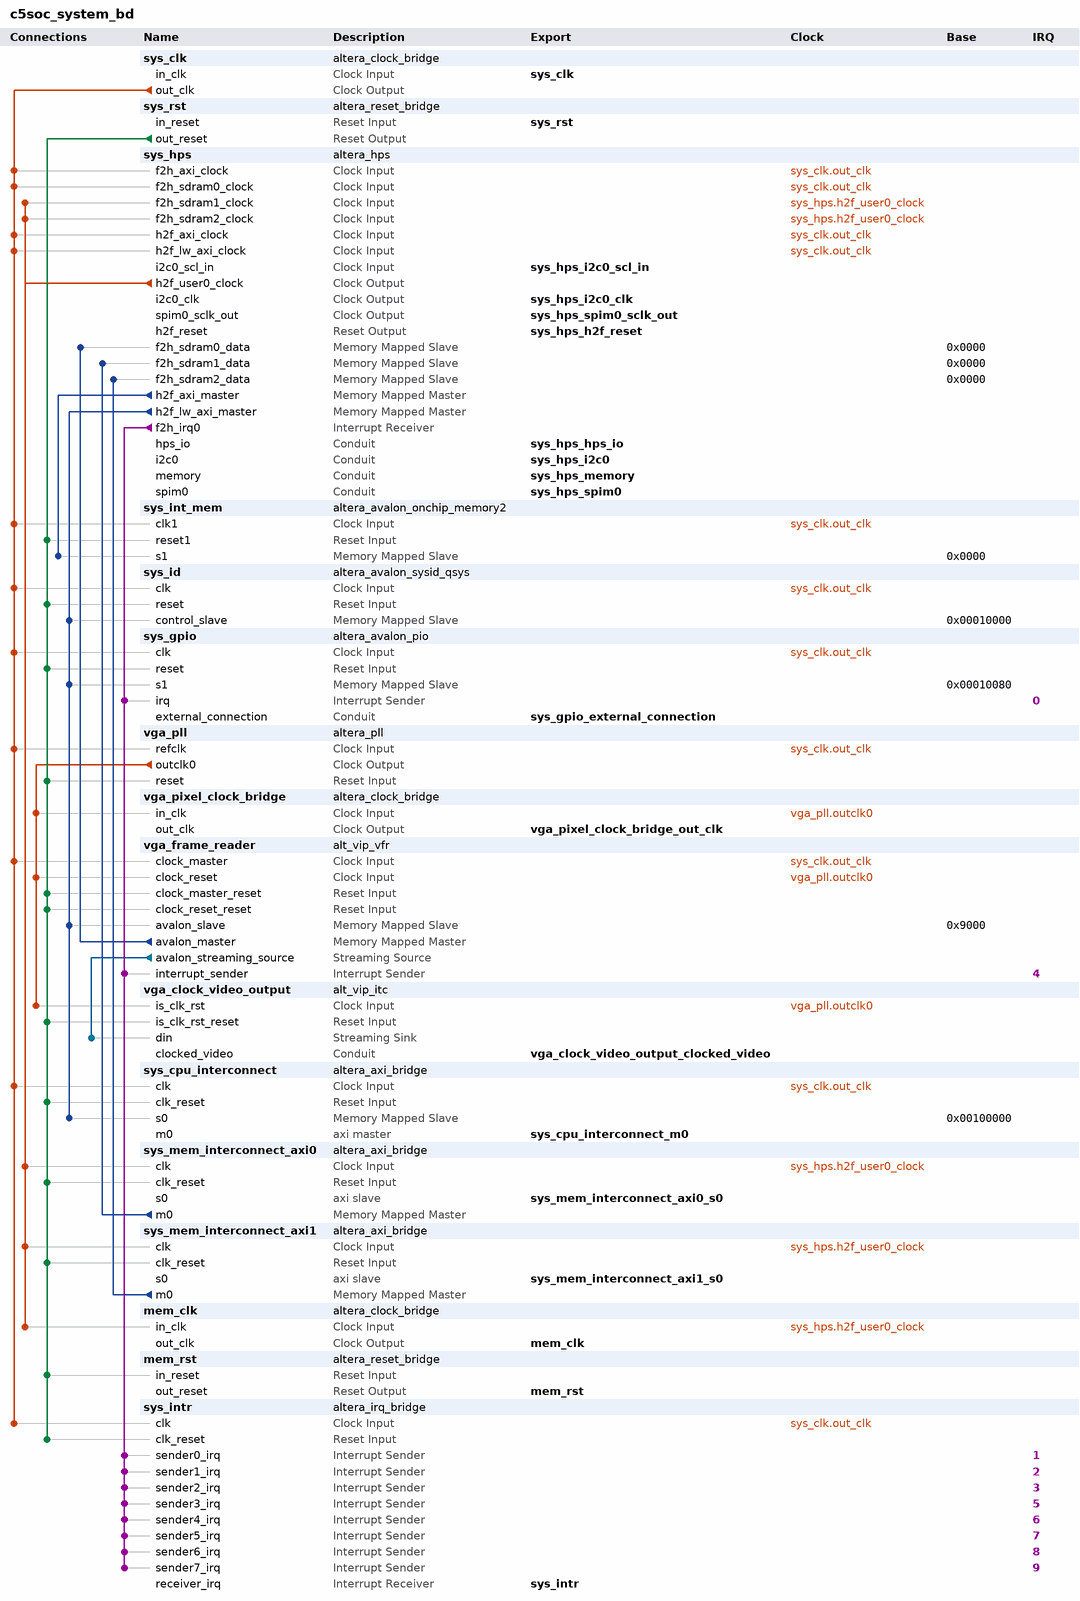
[diagram p0: system contents]
# Platform Designer (Qsys) system c5soc_system_bd, Cyclone V 5CSXFC6D6F31C8ES
# Parameters at their usual value, and those the tool derives, are not listed.
package require -exact qsys 16.0
create_system c5soc_system_bd
set_project_property DEVICE_FAMILY {Cyclone V}
set_project_property DEVICE 5CSXFC6D6F31C8ES

add_instance sys_clk altera_clock_bridge 16.0
set_instance_parameter_value sys_clk DERIVED_CLOCK_RATE 0
set_instance_parameter_value sys_clk EXPLICIT_CLOCK_RATE 0

add_instance sys_rst altera_reset_bridge 16.0
set_instance_parameter_value sys_rst ACTIVE_LOW_RESET 0
set_instance_parameter_value sys_rst SYNCHRONOUS_EDGES none

add_instance sys_hps altera_hps 16.0
set_instance_parameter_value sys_hps EMAC1_Mode RGMII
set_instance_parameter_value sys_hps EMAC1_PinMuxing {HPS I/O Set 0}
set_instance_parameter_value sys_hps F2SCLK_COLDRST_Enable false
set_instance_parameter_value sys_hps F2SCLK_DBGRST_Enable false
set_instance_parameter_value sys_hps F2SCLK_WARMRST_Enable false
set_instance_parameter_value sys_hps F2SDRAM_Type {Avalon-MM Bidirectional,AXI-3,AXI-3}
set_instance_parameter_value sys_hps F2SDRAM_Width 64,64,64
set_instance_parameter_value sys_hps F2SINTERRUPT_Enable true
set_instance_parameter_value sys_hps F2S_Width 2
set_instance_parameter_value sys_hps FPGA_PERIPHERAL_OUTPUT_CLOCK_FREQ_EMAC0_GTX_CLK 100
set_instance_parameter_value sys_hps FPGA_PERIPHERAL_OUTPUT_CLOCK_FREQ_EMAC0_MD_CLK 100.0
set_instance_parameter_value sys_hps FPGA_PERIPHERAL_OUTPUT_CLOCK_FREQ_EMAC1_GTX_CLK 100
set_instance_parameter_value sys_hps FPGA_PERIPHERAL_OUTPUT_CLOCK_FREQ_EMAC1_MD_CLK 100.0
set_instance_parameter_value sys_hps HPS_PROTOCOL DDR3
set_instance_parameter_value sys_hps I2C0_Mode Full
set_instance_parameter_value sys_hps I2C0_PinMuxing FPGA
set_instance_parameter_value sys_hps I2C1_Mode N/A
set_instance_parameter_value sys_hps I2C1_PinMuxing Unused
set_instance_parameter_value sys_hps LWH2F_Enable true
set_instance_parameter_value sys_hps MEM_BANKADDR_WIDTH 3
set_instance_parameter_value sys_hps MEM_CLK_FREQ 400.0
set_instance_parameter_value sys_hps MEM_COL_ADDR_WIDTH 10
set_instance_parameter_value sys_hps MEM_DQ_WIDTH 32
set_instance_parameter_value sys_hps MEM_DRV_STR RZQ/7
set_instance_parameter_value sys_hps MEM_ROW_ADDR_WIDTH 15
set_instance_parameter_value sys_hps MEM_RTT_NOM RZQ/4
set_instance_parameter_value sys_hps MEM_RTT_WR RZQ/4
set_instance_parameter_value sys_hps MEM_TCL 11
set_instance_parameter_value sys_hps MEM_TFAW_NS 30.0
set_instance_parameter_value sys_hps MEM_TRAS_NS 35.0
set_instance_parameter_value sys_hps MEM_TRCD_NS 13.75
set_instance_parameter_value sys_hps MEM_TRFC_NS 260.0
set_instance_parameter_value sys_hps MEM_TRP_NS 13.75
set_instance_parameter_value sys_hps MEM_VENDOR JEDEC
set_instance_parameter_value sys_hps MEM_WTCL 8
set_instance_parameter_value sys_hps QSPI_Mode {1 SS}
set_instance_parameter_value sys_hps QSPI_PinMuxing {HPS I/O Set 0}
set_instance_parameter_value sys_hps REF_CLK_FREQ 25.0
set_instance_parameter_value sys_hps S2FCLK_USER0CLK_Enable true
set_instance_parameter_value sys_hps S2FCLK_USER2CLK 4
set_instance_parameter_value sys_hps S2F_Width 2
set_instance_parameter_value sys_hps SDIO_Mode {4-bit Data}
set_instance_parameter_value sys_hps SDIO_PinMuxing {HPS I/O Set 0}
set_instance_parameter_value sys_hps SPIM0_Mode Full
set_instance_parameter_value sys_hps SPIM0_PinMuxing FPGA
set_instance_parameter_value sys_hps SPIM1_Mode {Single Slave Select}
set_instance_parameter_value sys_hps SPIM1_PinMuxing {HPS I/O Set 0}
set_instance_parameter_value sys_hps STM_Enable false
set_instance_parameter_value sys_hps TIMING_BOARD_AC_SKEW 0.03
set_instance_parameter_value sys_hps TIMING_BOARD_AC_TO_CK_SKEW 0.0
set_instance_parameter_value sys_hps TIMING_BOARD_DQ_TO_DQS_SKEW 0.0
set_instance_parameter_value sys_hps TIMING_BOARD_MAX_CK_DELAY 0.03
set_instance_parameter_value sys_hps TIMING_BOARD_MAX_DQS_DELAY 0.02
set_instance_parameter_value sys_hps TIMING_BOARD_SKEW_BETWEEN_DQS 0.08
set_instance_parameter_value sys_hps TIMING_BOARD_SKEW_CKDQS_DIMM_MAX 0.16
set_instance_parameter_value sys_hps TIMING_BOARD_SKEW_CKDQS_DIMM_MIN 0.09
set_instance_parameter_value sys_hps TIMING_BOARD_SKEW_WITHIN_DQS 0.01
set_instance_parameter_value sys_hps TIMING_TDH 65
set_instance_parameter_value sys_hps TIMING_TDQSCK 255
set_instance_parameter_value sys_hps TIMING_TDQSQ 125
set_instance_parameter_value sys_hps TIMING_TDS 30
set_instance_parameter_value sys_hps TIMING_TIH 140
set_instance_parameter_value sys_hps TIMING_TIS 180
set_instance_parameter_value sys_hps TIMING_TQSH 0.4
set_instance_parameter_value sys_hps UART0_Mode {No Flow Control}
set_instance_parameter_value sys_hps UART0_PinMuxing {HPS I/O Set 0}
set_instance_parameter_value sys_hps USB1_Mode SDR
set_instance_parameter_value sys_hps USB1_PinMuxing {HPS I/O Set 0}
set_instance_parameter_value sys_hps desired_cfg_clk_mhz 80.0
set_instance_parameter_value sys_hps desired_qspi_clk_mhz 400.0

add_instance sys_int_mem altera_avalon_onchip_memory2 16.0
set_instance_parameter_value sys_int_mem dataWidth 64
set_instance_parameter_value sys_int_mem dualPort false
set_instance_parameter_value sys_int_mem initMemContent true
set_instance_parameter_value sys_int_mem initializationFileName onchip_memory2_0
set_instance_parameter_value sys_int_mem memorySize 65536

add_instance sys_id altera_avalon_sysid_qsys 16.0
set_instance_parameter_value sys_id id -1395322110

add_instance sys_gpio altera_avalon_pio 16.0
set_instance_parameter_value sys_gpio bitClearingEdgeCapReg true
set_instance_parameter_value sys_gpio captureEdge true
set_instance_parameter_value sys_gpio direction InOut
set_instance_parameter_value sys_gpio edgeType ANY
set_instance_parameter_value sys_gpio generateIRQ true
set_instance_parameter_value sys_gpio irqType EDGE
set_instance_parameter_value sys_gpio width 32

add_instance vga_pll altera_pll 16.0
set_instance_parameter_value vga_pll gui_device_speed_grade 2
set_instance_parameter_value vga_pll gui_number_of_clocks 2
set_instance_parameter_value vga_pll gui_operation_mode direct
set_instance_parameter_value vga_pll gui_output_clock_frequency0 85.5
set_instance_parameter_value vga_pll gui_output_clock_frequency1 171.0
set_instance_parameter_value vga_pll gui_pll_mode {Integer-N PLL}
set_instance_parameter_value vga_pll gui_reference_clock_frequency 50.0
set_instance_parameter_value vga_pll gui_use_locked false

add_instance vga_pixel_clock_bridge altera_clock_bridge 16.0
set_instance_parameter_value vga_pixel_clock_bridge DERIVED_CLOCK_RATE 85500000
set_instance_parameter_value vga_pixel_clock_bridge EXPLICIT_CLOCK_RATE 0

add_instance vga_frame_reader alt_vip_vfr 14.0
set_instance_parameter_value vga_frame_reader MAX_IMAGE_WIDTH 1360

add_instance vga_clock_video_output alt_vip_itc 14.0
set_instance_parameter_value vga_clock_video_output FIFO_DEPTH 1920
set_instance_parameter_value vga_clock_video_output H_ACTIVE_PIXELS 1360
set_instance_parameter_value vga_clock_video_output H_BACK_PORCH 256
set_instance_parameter_value vga_clock_video_output H_FRONT_PORCH 64
set_instance_parameter_value vga_clock_video_output H_SYNC_LENGTH 112
set_instance_parameter_value vga_clock_video_output NUMBER_OF_COLOUR_PLANES 4
set_instance_parameter_value vga_clock_video_output THRESHOLD 1919
set_instance_parameter_value vga_clock_video_output V_ACTIVE_LINES 768
set_instance_parameter_value vga_clock_video_output V_BACK_PORCH 18
set_instance_parameter_value vga_clock_video_output V_FRONT_PORCH 3
set_instance_parameter_value vga_clock_video_output V_SYNC_LENGTH 6

add_instance sys_cpu_interconnect altera_axi_bridge 16.0
set_instance_parameter_value sys_cpu_interconnect ADDR_WIDTH 20
set_instance_parameter_value sys_cpu_interconnect AXI_VERSION AXI3
set_instance_parameter_value sys_cpu_interconnect COMBINED_ACCEPTANCE_CAPABILITY 16
set_instance_parameter_value sys_cpu_interconnect COMBINED_ISSUING_CAPABILITY 16
set_instance_parameter_value sys_cpu_interconnect DATA_WIDTH 32
set_instance_parameter_value sys_cpu_interconnect M0_ID_WIDTH 12
set_instance_parameter_value sys_cpu_interconnect READ_ACCEPTANCE_CAPABILITY 16
set_instance_parameter_value sys_cpu_interconnect READ_ADDR_USER_WIDTH 64
set_instance_parameter_value sys_cpu_interconnect READ_DATA_REORDERING_DEPTH 1
set_instance_parameter_value sys_cpu_interconnect READ_DATA_USER_WIDTH 64
set_instance_parameter_value sys_cpu_interconnect READ_ISSUING_CAPABILITY 16
set_instance_parameter_value sys_cpu_interconnect S0_ID_WIDTH 12
set_instance_parameter_value sys_cpu_interconnect USE_M0_ARBURST 1
set_instance_parameter_value sys_cpu_interconnect USE_M0_ARCACHE 1
set_instance_parameter_value sys_cpu_interconnect USE_M0_ARID 1
set_instance_parameter_value sys_cpu_interconnect USE_M0_ARLEN 1
set_instance_parameter_value sys_cpu_interconnect USE_M0_ARLOCK 1
set_instance_parameter_value sys_cpu_interconnect USE_M0_ARQOS 1
set_instance_parameter_value sys_cpu_interconnect USE_M0_ARREGION 1
set_instance_parameter_value sys_cpu_interconnect USE_M0_ARSIZE 1
set_instance_parameter_value sys_cpu_interconnect USE_M0_ARUSER 0
set_instance_parameter_value sys_cpu_interconnect USE_M0_AWBURST 1
set_instance_parameter_value sys_cpu_interconnect USE_M0_AWCACHE 1
set_instance_parameter_value sys_cpu_interconnect USE_M0_AWID 1
set_instance_parameter_value sys_cpu_interconnect USE_M0_AWLEN 1
set_instance_parameter_value sys_cpu_interconnect USE_M0_AWLOCK 1
set_instance_parameter_value sys_cpu_interconnect USE_M0_AWQOS 1
set_instance_parameter_value sys_cpu_interconnect USE_M0_AWREGION 1
set_instance_parameter_value sys_cpu_interconnect USE_M0_AWSIZE 1
set_instance_parameter_value sys_cpu_interconnect USE_M0_AWUSER 0
set_instance_parameter_value sys_cpu_interconnect USE_M0_BID 1
set_instance_parameter_value sys_cpu_interconnect USE_M0_BRESP 1
set_instance_parameter_value sys_cpu_interconnect USE_M0_BUSER 0
set_instance_parameter_value sys_cpu_interconnect USE_M0_RID 1
set_instance_parameter_value sys_cpu_interconnect USE_M0_RLAST 1
set_instance_parameter_value sys_cpu_interconnect USE_M0_RRESP 1
set_instance_parameter_value sys_cpu_interconnect USE_M0_RUSER 0
set_instance_parameter_value sys_cpu_interconnect USE_M0_WSTRB 1
set_instance_parameter_value sys_cpu_interconnect USE_M0_WUSER 0
set_instance_parameter_value sys_cpu_interconnect USE_PIPELINE 1
set_instance_parameter_value sys_cpu_interconnect USE_S0_ARCACHE 1
set_instance_parameter_value sys_cpu_interconnect USE_S0_ARLOCK 1
set_instance_parameter_value sys_cpu_interconnect USE_S0_ARPROT 1
set_instance_parameter_value sys_cpu_interconnect USE_S0_ARQOS 1
set_instance_parameter_value sys_cpu_interconnect USE_S0_ARREGION 1
set_instance_parameter_value sys_cpu_interconnect USE_S0_ARUSER 0
set_instance_parameter_value sys_cpu_interconnect USE_S0_AWCACHE 1
set_instance_parameter_value sys_cpu_interconnect USE_S0_AWLOCK 1
set_instance_parameter_value sys_cpu_interconnect USE_S0_AWPROT 1
set_instance_parameter_value sys_cpu_interconnect USE_S0_AWQOS 1
set_instance_parameter_value sys_cpu_interconnect USE_S0_AWREGION 1
set_instance_parameter_value sys_cpu_interconnect USE_S0_AWUSER 0
set_instance_parameter_value sys_cpu_interconnect USE_S0_BRESP 1
set_instance_parameter_value sys_cpu_interconnect USE_S0_BUSER 0
set_instance_parameter_value sys_cpu_interconnect USE_S0_RRESP 1
set_instance_parameter_value sys_cpu_interconnect USE_S0_RUSER 0
set_instance_parameter_value sys_cpu_interconnect USE_S0_WLAST 1
set_instance_parameter_value sys_cpu_interconnect USE_S0_WUSER 0
set_instance_parameter_value sys_cpu_interconnect WRITE_ACCEPTANCE_CAPABILITY 16
set_instance_parameter_value sys_cpu_interconnect WRITE_ADDR_USER_WIDTH 64
set_instance_parameter_value sys_cpu_interconnect WRITE_DATA_USER_WIDTH 64
set_instance_parameter_value sys_cpu_interconnect WRITE_ISSUING_CAPABILITY 16
set_instance_parameter_value sys_cpu_interconnect WRITE_RESP_USER_WIDTH 64

add_instance sys_mem_interconnect_axi0 altera_axi_bridge 16.0
set_instance_parameter_value sys_mem_interconnect_axi0 ADDR_WIDTH 32
set_instance_parameter_value sys_mem_interconnect_axi0 AXI_VERSION AXI3
set_instance_parameter_value sys_mem_interconnect_axi0 COMBINED_ACCEPTANCE_CAPABILITY 16
set_instance_parameter_value sys_mem_interconnect_axi0 COMBINED_ISSUING_CAPABILITY 16
set_instance_parameter_value sys_mem_interconnect_axi0 DATA_WIDTH 64
set_instance_parameter_value sys_mem_interconnect_axi0 M0_ID_WIDTH 4
set_instance_parameter_value sys_mem_interconnect_axi0 READ_ACCEPTANCE_CAPABILITY 16
set_instance_parameter_value sys_mem_interconnect_axi0 READ_ADDR_USER_WIDTH 64
set_instance_parameter_value sys_mem_interconnect_axi0 READ_DATA_REORDERING_DEPTH 1
set_instance_parameter_value sys_mem_interconnect_axi0 READ_DATA_USER_WIDTH 64
set_instance_parameter_value sys_mem_interconnect_axi0 READ_ISSUING_CAPABILITY 16
set_instance_parameter_value sys_mem_interconnect_axi0 S0_ID_WIDTH 4
set_instance_parameter_value sys_mem_interconnect_axi0 USE_M0_ARBURST 1
set_instance_parameter_value sys_mem_interconnect_axi0 USE_M0_ARCACHE 1
set_instance_parameter_value sys_mem_interconnect_axi0 USE_M0_ARID 1
set_instance_parameter_value sys_mem_interconnect_axi0 USE_M0_ARLEN 1
set_instance_parameter_value sys_mem_interconnect_axi0 USE_M0_ARLOCK 1
set_instance_parameter_value sys_mem_interconnect_axi0 USE_M0_ARQOS 1
set_instance_parameter_value sys_mem_interconnect_axi0 USE_M0_ARREGION 1
set_instance_parameter_value sys_mem_interconnect_axi0 USE_M0_ARSIZE 1
set_instance_parameter_value sys_mem_interconnect_axi0 USE_M0_ARUSER 0
set_instance_parameter_value sys_mem_interconnect_axi0 USE_M0_AWBURST 1
set_instance_parameter_value sys_mem_interconnect_axi0 USE_M0_AWCACHE 1
set_instance_parameter_value sys_mem_interconnect_axi0 USE_M0_AWID 1
set_instance_parameter_value sys_mem_interconnect_axi0 USE_M0_AWLEN 1
set_instance_parameter_value sys_mem_interconnect_axi0 USE_M0_AWLOCK 1
set_instance_parameter_value sys_mem_interconnect_axi0 USE_M0_AWQOS 1
set_instance_parameter_value sys_mem_interconnect_axi0 USE_M0_AWREGION 1
set_instance_parameter_value sys_mem_interconnect_axi0 USE_M0_AWSIZE 1
set_instance_parameter_value sys_mem_interconnect_axi0 USE_M0_AWUSER 0
set_instance_parameter_value sys_mem_interconnect_axi0 USE_M0_BID 1
set_instance_parameter_value sys_mem_interconnect_axi0 USE_M0_BRESP 1
set_instance_parameter_value sys_mem_interconnect_axi0 USE_M0_BUSER 0
set_instance_parameter_value sys_mem_interconnect_axi0 USE_M0_RID 1
set_instance_parameter_value sys_mem_interconnect_axi0 USE_M0_RLAST 1
set_instance_parameter_value sys_mem_interconnect_axi0 USE_M0_RRESP 1
set_instance_parameter_value sys_mem_interconnect_axi0 USE_M0_RUSER 0
set_instance_parameter_value sys_mem_interconnect_axi0 USE_M0_WSTRB 1
set_instance_parameter_value sys_mem_interconnect_axi0 USE_M0_WUSER 0
set_instance_parameter_value sys_mem_interconnect_axi0 USE_PIPELINE 1
set_instance_parameter_value sys_mem_interconnect_axi0 USE_S0_ARCACHE 1
set_instance_parameter_value sys_mem_interconnect_axi0 USE_S0_ARLOCK 1
set_instance_parameter_value sys_mem_interconnect_axi0 USE_S0_ARPROT 1
set_instance_parameter_value sys_mem_interconnect_axi0 USE_S0_ARQOS 1
set_instance_parameter_value sys_mem_interconnect_axi0 USE_S0_ARREGION 1
set_instance_parameter_value sys_mem_interconnect_axi0 USE_S0_ARUSER 0
set_instance_parameter_value sys_mem_interconnect_axi0 USE_S0_AWCACHE 1
set_instance_parameter_value sys_mem_interconnect_axi0 USE_S0_AWLOCK 1
set_instance_parameter_value sys_mem_interconnect_axi0 USE_S0_AWPROT 1
set_instance_parameter_value sys_mem_interconnect_axi0 USE_S0_AWQOS 1
set_instance_parameter_value sys_mem_interconnect_axi0 USE_S0_AWREGION 1
set_instance_parameter_value sys_mem_interconnect_axi0 USE_S0_AWUSER 0
set_instance_parameter_value sys_mem_interconnect_axi0 USE_S0_BRESP 1
set_instance_parameter_value sys_mem_interconnect_axi0 USE_S0_BUSER 0
set_instance_parameter_value sys_mem_interconnect_axi0 USE_S0_RRESP 1
set_instance_parameter_value sys_mem_interconnect_axi0 USE_S0_RUSER 0
set_instance_parameter_value sys_mem_interconnect_axi0 USE_S0_WLAST 1
set_instance_parameter_value sys_mem_interconnect_axi0 USE_S0_WUSER 0
set_instance_parameter_value sys_mem_interconnect_axi0 WRITE_ACCEPTANCE_CAPABILITY 16
set_instance_parameter_value sys_mem_interconnect_axi0 WRITE_ADDR_USER_WIDTH 64
set_instance_parameter_value sys_mem_interconnect_axi0 WRITE_DATA_USER_WIDTH 64
set_instance_parameter_value sys_mem_interconnect_axi0 WRITE_ISSUING_CAPABILITY 16
set_instance_parameter_value sys_mem_interconnect_axi0 WRITE_RESP_USER_WIDTH 64

add_instance sys_mem_interconnect_axi1 altera_axi_bridge 16.0
set_instance_parameter_value sys_mem_interconnect_axi1 ADDR_WIDTH 32
set_instance_parameter_value sys_mem_interconnect_axi1 AXI_VERSION AXI3
set_instance_parameter_value sys_mem_interconnect_axi1 COMBINED_ACCEPTANCE_CAPABILITY 16
set_instance_parameter_value sys_mem_interconnect_axi1 COMBINED_ISSUING_CAPABILITY 16
set_instance_parameter_value sys_mem_interconnect_axi1 DATA_WIDTH 64
set_instance_parameter_value sys_mem_interconnect_axi1 M0_ID_WIDTH 8
set_instance_parameter_value sys_mem_interconnect_axi1 READ_ACCEPTANCE_CAPABILITY 16
set_instance_parameter_value sys_mem_interconnect_axi1 READ_ADDR_USER_WIDTH 64
set_instance_parameter_value sys_mem_interconnect_axi1 READ_DATA_REORDERING_DEPTH 1
set_instance_parameter_value sys_mem_interconnect_axi1 READ_DATA_USER_WIDTH 64
set_instance_parameter_value sys_mem_interconnect_axi1 READ_ISSUING_CAPABILITY 16
set_instance_parameter_value sys_mem_interconnect_axi1 S0_ID_WIDTH 8
set_instance_parameter_value sys_mem_interconnect_axi1 USE_M0_ARBURST 1
set_instance_parameter_value sys_mem_interconnect_axi1 USE_M0_ARCACHE 1
set_instance_parameter_value sys_mem_interconnect_axi1 USE_M0_ARID 1
set_instance_parameter_value sys_mem_interconnect_axi1 USE_M0_ARLEN 1
set_instance_parameter_value sys_mem_interconnect_axi1 USE_M0_ARLOCK 1
set_instance_parameter_value sys_mem_interconnect_axi1 USE_M0_ARQOS 1
set_instance_parameter_value sys_mem_interconnect_axi1 USE_M0_ARREGION 1
set_instance_parameter_value sys_mem_interconnect_axi1 USE_M0_ARSIZE 1
set_instance_parameter_value sys_mem_interconnect_axi1 USE_M0_ARUSER 0
set_instance_parameter_value sys_mem_interconnect_axi1 USE_M0_AWBURST 1
set_instance_parameter_value sys_mem_interconnect_axi1 USE_M0_AWCACHE 1
set_instance_parameter_value sys_mem_interconnect_axi1 USE_M0_AWID 1
set_instance_parameter_value sys_mem_interconnect_axi1 USE_M0_AWLEN 1
set_instance_parameter_value sys_mem_interconnect_axi1 USE_M0_AWLOCK 1
set_instance_parameter_value sys_mem_interconnect_axi1 USE_M0_AWQOS 1
set_instance_parameter_value sys_mem_interconnect_axi1 USE_M0_AWREGION 1
set_instance_parameter_value sys_mem_interconnect_axi1 USE_M0_AWSIZE 1
set_instance_parameter_value sys_mem_interconnect_axi1 USE_M0_AWUSER 0
set_instance_parameter_value sys_mem_interconnect_axi1 USE_M0_BID 1
set_instance_parameter_value sys_mem_interconnect_axi1 USE_M0_BRESP 1
set_instance_parameter_value sys_mem_interconnect_axi1 USE_M0_BUSER 0
set_instance_parameter_value sys_mem_interconnect_axi1 USE_M0_RID 1
set_instance_parameter_value sys_mem_interconnect_axi1 USE_M0_RLAST 1
set_instance_parameter_value sys_mem_interconnect_axi1 USE_M0_RRESP 1
set_instance_parameter_value sys_mem_interconnect_axi1 USE_M0_RUSER 0
set_instance_parameter_value sys_mem_interconnect_axi1 USE_M0_WSTRB 1
set_instance_parameter_value sys_mem_interconnect_axi1 USE_M0_WUSER 0
set_instance_parameter_value sys_mem_interconnect_axi1 USE_PIPELINE 1
set_instance_parameter_value sys_mem_interconnect_axi1 USE_S0_ARCACHE 1
set_instance_parameter_value sys_mem_interconnect_axi1 USE_S0_ARLOCK 1
set_instance_parameter_value sys_mem_interconnect_axi1 USE_S0_ARPROT 1
set_instance_parameter_value sys_mem_interconnect_axi1 USE_S0_ARQOS 1
set_instance_parameter_value sys_mem_interconnect_axi1 USE_S0_ARREGION 1
set_instance_parameter_value sys_mem_interconnect_axi1 USE_S0_ARUSER 0
set_instance_parameter_value sys_mem_interconnect_axi1 USE_S0_AWCACHE 1
set_instance_parameter_value sys_mem_interconnect_axi1 USE_S0_AWLOCK 1
set_instance_parameter_value sys_mem_interconnect_axi1 USE_S0_AWPROT 1
set_instance_parameter_value sys_mem_interconnect_axi1 USE_S0_AWQOS 1
set_instance_parameter_value sys_mem_interconnect_axi1 USE_S0_AWREGION 1
set_instance_parameter_value sys_mem_interconnect_axi1 USE_S0_AWUSER 0
set_instance_parameter_value sys_mem_interconnect_axi1 USE_S0_BRESP 1
set_instance_parameter_value sys_mem_interconnect_axi1 USE_S0_BUSER 0
set_instance_parameter_value sys_mem_interconnect_axi1 USE_S0_RRESP 1
set_instance_parameter_value sys_mem_interconnect_axi1 USE_S0_RUSER 0
set_instance_parameter_value sys_mem_interconnect_axi1 USE_S0_WLAST 1
set_instance_parameter_value sys_mem_interconnect_axi1 USE_S0_WUSER 0
set_instance_parameter_value sys_mem_interconnect_axi1 WRITE_ACCEPTANCE_CAPABILITY 16
set_instance_parameter_value sys_mem_interconnect_axi1 WRITE_ADDR_USER_WIDTH 64
set_instance_parameter_value sys_mem_interconnect_axi1 WRITE_DATA_USER_WIDTH 64
set_instance_parameter_value sys_mem_interconnect_axi1 WRITE_ISSUING_CAPABILITY 16
set_instance_parameter_value sys_mem_interconnect_axi1 WRITE_RESP_USER_WIDTH 64

add_instance mem_clk altera_clock_bridge 16.0
set_instance_parameter_value mem_clk DERIVED_CLOCK_RATE 80000000
set_instance_parameter_value mem_clk EXPLICIT_CLOCK_RATE 0

add_instance mem_rst altera_reset_bridge 16.0
set_instance_parameter_value mem_rst ACTIVE_LOW_RESET 0
set_instance_parameter_value mem_rst SYNCHRONOUS_EDGES none

add_instance sys_intr altera_irq_bridge 16.0
set_instance_parameter_value sys_intr IRQ_WIDTH 8

# connections
add_connection sys_clk.out_clk sys_cpu_interconnect.clk clock
add_connection sys_clk.out_clk sys_gpio.clk clock
add_connection sys_clk.out_clk sys_hps.f2h_axi_clock clock
add_connection sys_clk.out_clk sys_hps.f2h_sdram0_clock clock
add_connection sys_clk.out_clk sys_hps.h2f_axi_clock clock
add_connection sys_clk.out_clk sys_hps.h2f_lw_axi_clock clock
add_connection sys_clk.out_clk sys_id.clk clock
add_connection sys_clk.out_clk sys_int_mem.clk1 clock
add_connection sys_clk.out_clk sys_intr.clk clock
add_connection sys_clk.out_clk vga_frame_reader.clock_master clock
add_connection sys_clk.out_clk vga_pll.refclk clock
add_connection sys_hps.h2f_user0_clock mem_clk.in_clk clock
add_connection sys_hps.h2f_user0_clock sys_hps.f2h_sdram1_clock clock
add_connection sys_hps.h2f_user0_clock sys_hps.f2h_sdram2_clock clock
add_connection sys_hps.h2f_user0_clock sys_mem_interconnect_axi0.clk clock
add_connection sys_hps.h2f_user0_clock sys_mem_interconnect_axi1.clk clock
add_connection vga_pll.outclk0 vga_clock_video_output.is_clk_rst clock
add_connection vga_pll.outclk0 vga_frame_reader.clock_reset clock
add_connection vga_pll.outclk0 vga_pixel_clock_bridge.in_clk clock
add_connection sys_rst.out_reset mem_rst.in_reset reset
add_connection sys_rst.out_reset sys_cpu_interconnect.clk_reset reset
add_connection sys_rst.out_reset sys_gpio.reset reset
add_connection sys_rst.out_reset sys_id.reset reset
add_connection sys_rst.out_reset sys_int_mem.reset1 reset
add_connection sys_rst.out_reset sys_intr.clk_reset reset
add_connection sys_rst.out_reset sys_mem_interconnect_axi0.clk_reset reset
add_connection sys_rst.out_reset sys_mem_interconnect_axi1.clk_reset reset
add_connection sys_rst.out_reset vga_clock_video_output.is_clk_rst_reset reset
add_connection sys_rst.out_reset vga_frame_reader.clock_master_reset reset
add_connection sys_rst.out_reset vga_frame_reader.clock_reset_reset reset
add_connection sys_rst.out_reset vga_pll.reset reset
add_connection sys_hps.h2f_axi_master sys_int_mem.s1 avalon
set_connection_parameter_value sys_hps.h2f_axi_master/sys_int_mem.s1 baseAddress 0x0000
add_connection sys_hps.h2f_lw_axi_master sys_cpu_interconnect.s0 avalon
set_connection_parameter_value sys_hps.h2f_lw_axi_master/sys_cpu_interconnect.s0 baseAddress 0x00100000
add_connection sys_hps.h2f_lw_axi_master sys_gpio.s1 avalon
set_connection_parameter_value sys_hps.h2f_lw_axi_master/sys_gpio.s1 baseAddress 0x00010080
add_connection sys_hps.h2f_lw_axi_master sys_id.control_slave avalon
set_connection_parameter_value sys_hps.h2f_lw_axi_master/sys_id.control_slave baseAddress 0x00010000
add_connection sys_hps.h2f_lw_axi_master vga_frame_reader.avalon_slave avalon
set_connection_parameter_value sys_hps.h2f_lw_axi_master/vga_frame_reader.avalon_slave baseAddress 0x9000
add_connection sys_mem_interconnect_axi0.m0 sys_hps.f2h_sdram1_data avalon
set_connection_parameter_value sys_mem_interconnect_axi0.m0/sys_hps.f2h_sdram1_data baseAddress 0x0000
add_connection sys_mem_interconnect_axi1.m0 sys_hps.f2h_sdram2_data avalon
set_connection_parameter_value sys_mem_interconnect_axi1.m0/sys_hps.f2h_sdram2_data baseAddress 0x0000
add_connection vga_frame_reader.avalon_master sys_hps.f2h_sdram0_data avalon
set_connection_parameter_value vga_frame_reader.avalon_master/sys_hps.f2h_sdram0_data baseAddress 0x0000
add_connection vga_frame_reader.avalon_streaming_source vga_clock_video_output.din avalon_streaming
add_connection sys_hps.f2h_irq0 sys_gpio.irq interrupt
set_connection_parameter_value sys_hps.f2h_irq0/sys_gpio.irq irqNumber 0
add_connection sys_hps.f2h_irq0 sys_intr.sender0_irq interrupt
set_connection_parameter_value sys_hps.f2h_irq0/sys_intr.sender0_irq irqNumber 1
add_connection sys_hps.f2h_irq0 sys_intr.sender1_irq interrupt
set_connection_parameter_value sys_hps.f2h_irq0/sys_intr.sender1_irq irqNumber 2
add_connection sys_hps.f2h_irq0 sys_intr.sender2_irq interrupt
set_connection_parameter_value sys_hps.f2h_irq0/sys_intr.sender2_irq irqNumber 3
add_connection sys_hps.f2h_irq0 sys_intr.sender3_irq interrupt
set_connection_parameter_value sys_hps.f2h_irq0/sys_intr.sender3_irq irqNumber 5
add_connection sys_hps.f2h_irq0 sys_intr.sender4_irq interrupt
set_connection_parameter_value sys_hps.f2h_irq0/sys_intr.sender4_irq irqNumber 6
add_connection sys_hps.f2h_irq0 sys_intr.sender5_irq interrupt
set_connection_parameter_value sys_hps.f2h_irq0/sys_intr.sender5_irq irqNumber 7
add_connection sys_hps.f2h_irq0 sys_intr.sender6_irq interrupt
set_connection_parameter_value sys_hps.f2h_irq0/sys_intr.sender6_irq irqNumber 8
add_connection sys_hps.f2h_irq0 sys_intr.sender7_irq interrupt
set_connection_parameter_value sys_hps.f2h_irq0/sys_intr.sender7_irq irqNumber 9
add_connection sys_hps.f2h_irq0 vga_frame_reader.interrupt_sender interrupt
set_connection_parameter_value sys_hps.f2h_irq0/vga_frame_reader.interrupt_sender irqNumber 4

# exported interfaces
add_interface mem_clk clock source
set_interface_property mem_clk EXPORT_OF mem_clk.out_clk
add_interface mem_rst reset source
set_interface_property mem_rst EXPORT_OF mem_rst.out_reset
add_interface sys_clk clock sink
set_interface_property sys_clk EXPORT_OF sys_clk.in_clk
add_interface sys_cpu_interconnect_m0 axi master
set_interface_property sys_cpu_interconnect_m0 EXPORT_OF sys_cpu_interconnect.m0
add_interface sys_gpio_external_connection conduit end
set_interface_property sys_gpio_external_connection EXPORT_OF sys_gpio.external_connection
add_interface sys_hps_h2f_reset reset source
set_interface_property sys_hps_h2f_reset EXPORT_OF sys_hps.h2f_reset
add_interface sys_hps_hps_io conduit end
set_interface_property sys_hps_hps_io EXPORT_OF sys_hps.hps_io
add_interface sys_hps_i2c0 conduit end
set_interface_property sys_hps_i2c0 EXPORT_OF sys_hps.i2c0
add_interface sys_hps_i2c0_clk clock source
set_interface_property sys_hps_i2c0_clk EXPORT_OF sys_hps.i2c0_clk
add_interface sys_hps_i2c0_scl_in clock sink
set_interface_property sys_hps_i2c0_scl_in EXPORT_OF sys_hps.i2c0_scl_in
add_interface sys_hps_memory conduit end
set_interface_property sys_hps_memory EXPORT_OF sys_hps.memory
add_interface sys_hps_spim0 conduit end
set_interface_property sys_hps_spim0 EXPORT_OF sys_hps.spim0
add_interface sys_hps_spim0_sclk_out clock source
set_interface_property sys_hps_spim0_sclk_out EXPORT_OF sys_hps.spim0_sclk_out
add_interface sys_intr interrupt receiver
set_interface_property sys_intr EXPORT_OF sys_intr.receiver_irq
add_interface sys_mem_interconnect_axi0_s0 axi slave
set_interface_property sys_mem_interconnect_axi0_s0 EXPORT_OF sys_mem_interconnect_axi0.s0
add_interface sys_mem_interconnect_axi1_s0 axi slave
set_interface_property sys_mem_interconnect_axi1_s0 EXPORT_OF sys_mem_interconnect_axi1.s0
add_interface sys_rst reset sink
set_interface_property sys_rst EXPORT_OF sys_rst.in_reset
add_interface vga_clock_video_output_clocked_video conduit end
set_interface_property vga_clock_video_output_clocked_video EXPORT_OF vga_clock_video_output.clocked_video
add_interface vga_pixel_clock_bridge_out_clk clock source
set_interface_property vga_pixel_clock_bridge_out_clk EXPORT_OF vga_pixel_clock_bridge.out_clk

set_interconnect_requirement {$system} qsys_mm.clockCrossingAdapter FIFO
set_interconnect_requirement {$system} qsys_mm.maxAdditionalLatency 2
set_interconnect_requirement {mm_interconnect_0|cmd_mux} qsys_mm.postTransform.pipelineCount 0
set_interconnect_requirement {mm_interconnect_2|cmd_mux} qsys_mm.postTransform.pipelineCount 0
set_interconnect_requirement {mm_interconnect_3|cmd_mux} qsys_mm.postTransform.pipelineCount 0
set_interconnect_requirement {mm_interconnect_3|cmd_mux_001} qsys_mm.postTransform.pipelineCount 0
set_interconnect_requirement {mm_interconnect_4|axi_dmac_dac_m_src_axi_agent.write_cp/router.sink} qsys_mm.postTransform.pipelineCount 0
set_interconnect_requirement {mm_interconnect_4|cmd_mux} qsys_mm.postTransform.pipelineCount 0
set_interconnect_requirement {mm_interconnect_4|cmd_mux_001} qsys_mm.postTransform.pipelineCount 0

save_system c5soc_system_bd.qsys
